# EAGLE design midimixer-channel (EAGLE 7.5.0)

## Sheet 1 of 2
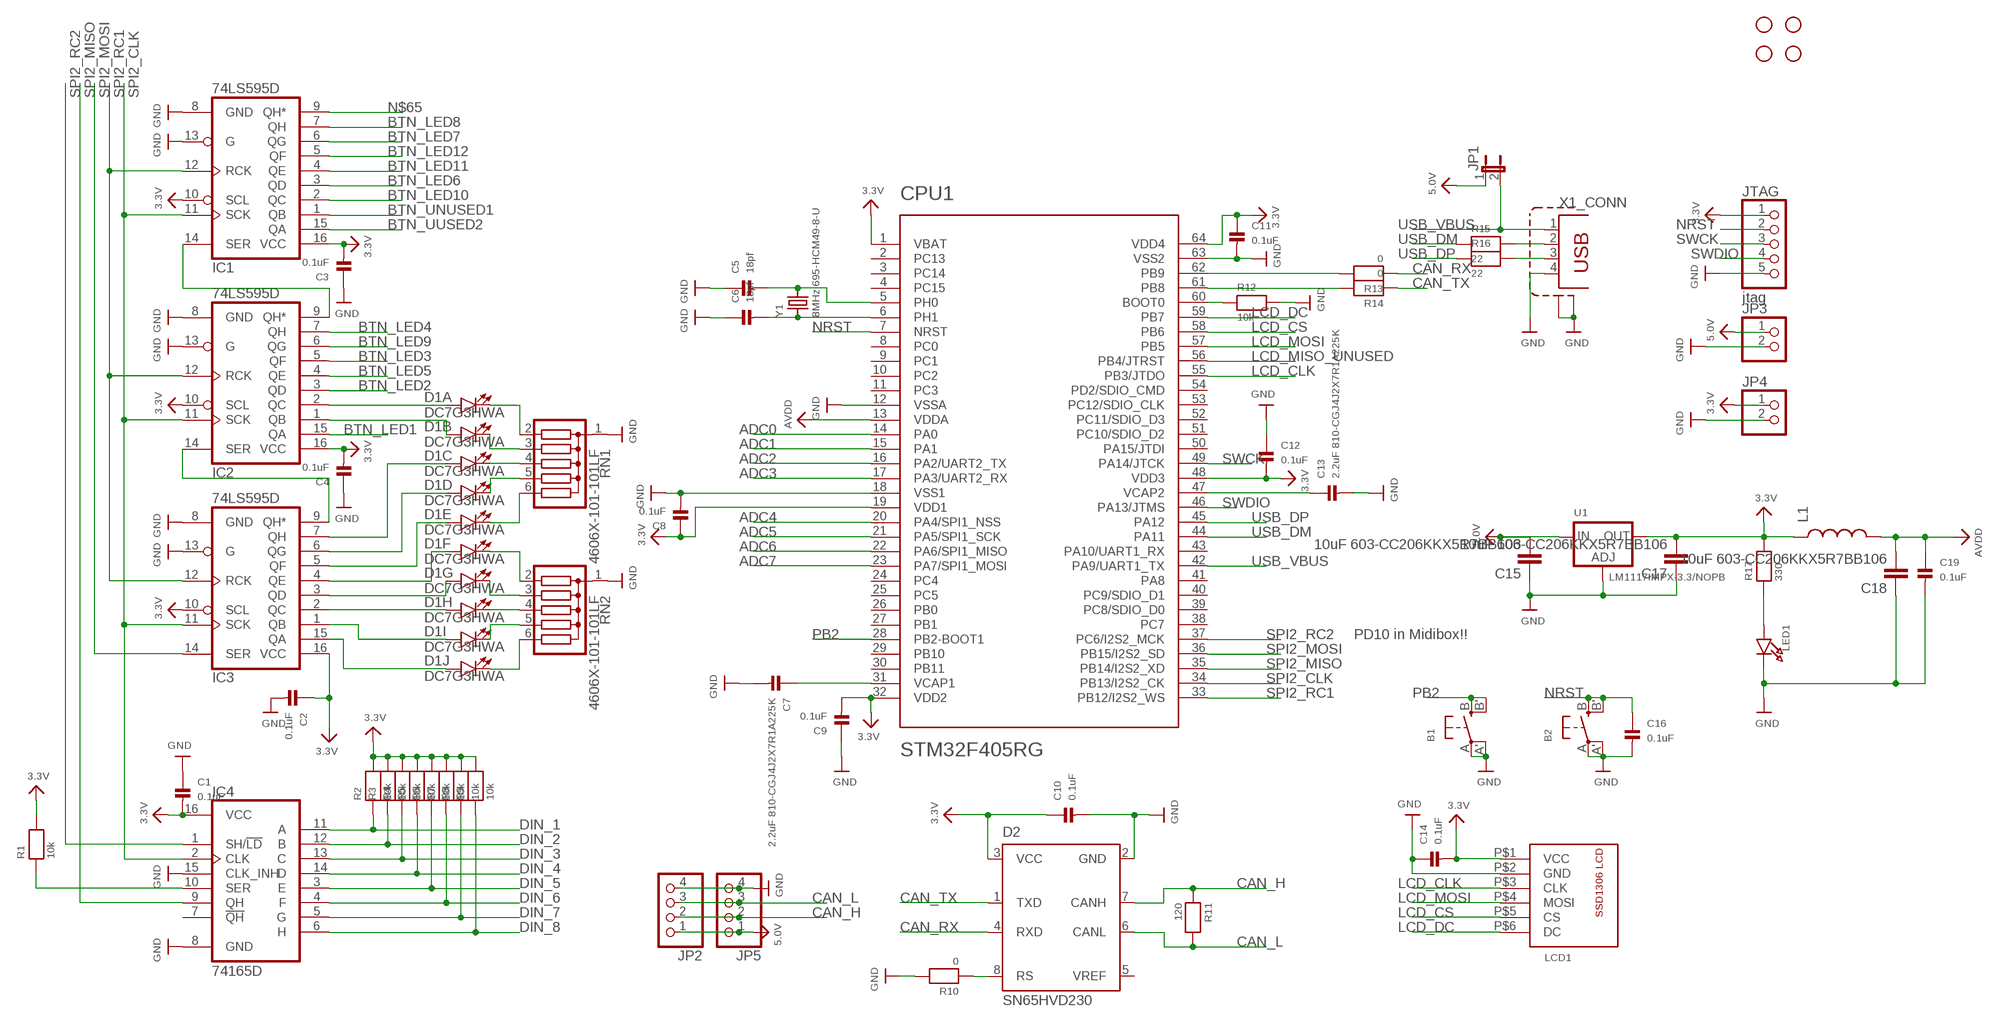
[diagram p0: schematic, sheet 1]

### Parts
B1  SWITCH_TACT_SMT  [EVQ-Q2]
B2  SWITCH_TACT_SMT  [EVQ-Q2]
C1  0.1uF  CAP_CERAMIC0603  [0603]
C2  0.1uF  CAP_CERAMIC0603  [0603]
C3  0.1uF  CAP_CERAMIC0603  [0603]
C4  0.1uF  CAP_CERAMIC0603  [0603]
C5  18pf  CAP_CERAMIC0603  [0603]
C6  18pf  CAP_CERAMIC0603  [0603]
C7  2.2uF 810-CGJ4J2X7R1A225K  CAP_CERAMIC0805  [0805]
C8  0.1uF  CAP_CERAMIC0603  [0603]
C9  0.1uF  CAP_CERAMIC0603  [0603]
C10  0.1uF  CAP_CERAMIC0603  [0603]
C11  0.1uF  CAP_CERAMIC0603  [0603]
C12  0.1uF  CAP_CERAMIC0603  [0603]
C13  2.2uF 810-CGJ4J2X7R1A225K  CAP_CERAMIC0805  [0805]
C14  0.1uF  CAP_CERAMIC0603  [0603]
C15  10uF 603-CC206KKX5R7BB106  CAP1206  [1206]
C16  0.1uF  CAP_CERAMIC0603  [0603]
C17  10uF 603-CC206KKX5R7BB106  CAP1206  [1206]
C18  10uF 603-CC206KKX5R7BB106  CAP1206  [1206]
C19  0.1uF  CAP_CERAMIC0603  [0603]
CPU1  STM32F405RG  [TQFP64]
D1  DC7G3HWA  LED_BARGRAPH_10  [LED_BARGAPH_10]
D2  SN65HVD230  [SO8]
H1  STAND-OFF  [STAND-OFF]
H2  STAND-OFF  [STAND-OFF]
H3  STAND-OFF  [STAND-OFF]
H4  STAND-OFF  [STAND-OFF]
IC1  74LS595D  [SO16]
IC2  74LS595D  [SO16]
IC3  74LS595D  [SO16]
IC4  74165D  [SO16]
JP1  JUMPER2  [JUMPER2]
JP2  HEADER-1X4ROUND  [1X04_ROUND]
JP3  HEADER-1X2ROUND  [1X02_ROUND]
JP4  HEADER-1X2ROUND  [1X02_ROUND]
JP5  HEADER-1X4ROUND  [1X04_ROUND]
JTAG  jtag  HEADER-1X576MIL  [1X05_ROUND_76]
L1  INDUCTOR0805  [0805]
LCD1  SSD1306-ALI  [SSD1306-ALI]
LED1  LED0603  [CHIPLED_0603]
R1  10k  RESISTOR_0603  [_0603]
R2  10k  RESISTOR_0603  [_0603]
R3  10k  RESISTOR_0603  [_0603]
R4  10k  RESISTOR_0603  [_0603]
R5  10k  RESISTOR_0603  [_0603]
R6  10k  RESISTOR_0603  [_0603]
R7  10k  RESISTOR_0603  [_0603]
R8  10k  RESISTOR_0603  [_0603]
R9  10k  RESISTOR_0603  [_0603]
R10  0  RESISTOR_0603  [_0603]
R11  120  RESISTOR_0603  [_0603]
R12  10k  RESISTOR_0603  [_0603]
R13  0  RESISTOR_0603  [_0603]
R14  0  RESISTOR_0603  [_0603]
R15  22  RESISTOR0603  [0603]
R16  22  RESISTOR0603  [0603]
R17  330  RESISTOR0603  [0603]
RN1  4606X-101-101LF  G05R  [SIL6]
RN2  4606X-101-101LF  G05R  [SIL6]
U1  LM1117IMPX-3.3/NOPB  LM1117SOT223-REFLOW  [SOT223-R]
X1  TE-292304-1  [TE-292304-1]
Y1  8MHz 695-HCM49-8-U  CRYSTALSMD  [HC49UP]

### Nets
3.3V: C1.2 C2.1 C3.2 C4.2 C8.1 C9.2 C10.1 C11.1 C12.2 C14.2 C17.2 CPU1.1(VBAT) CPU1.19(VDD1) CPU1.32(VDD2) CPU1.48(VDD3) CPU1.64(VDD4) D2.3(VCC) IC1.10(SCL) IC1.16(VCC) IC2.10(SCL) IC2.16(VCC) IC3.10(SCL) IC3.16(VCC) IC4.16(VCC) JP4.1 JTAG.1 L1.1 LCD1.P$1(VCC) R1.2 R2.2 R3.2 R4.2 R5.2 R6.2 R7.2 R8.2 R9.2 R17.2 U1.2(OUT) ; also sheet 2
5.0V: C15.2 JP1.1 JP2.1 JP3.1 JP5.1 U1.3(IN)
ADC0: CPU1.14(PA0) ; also sheet 2
ADC1: CPU1.15(PA1) ; also sheet 2
ADC2: CPU1.16(PA2/UART2_TX) ; also sheet 2
ADC3: CPU1.17(PA3/UART2_RX) ; also sheet 2
ADC4: CPU1.20(PA4/SPI1_NSS) ; also sheet 2
ADC5: CPU1.21(PA5/SPI1_SCK) ; also sheet 2
ADC6: CPU1.22(PA6/SPI1_MISO) ; also sheet 2
ADC7: CPU1.23(PA7/SPI1_MOSI) ; also sheet 2
AVDD: C18.2 C19.1 CPU1.13(VDDA) L1.2
BTN_LED1: IC2.15(QA) ; also sheet 2
BTN_LED2: IC2.3(QD) ; also sheet 2
BTN_LED3: IC2.5(QF) ; also sheet 2
BTN_LED4: IC2.7(QH) ; also sheet 2
BTN_LED5: IC2.4(QE) ; also sheet 2
BTN_LED6: IC1.3(QD) ; also sheet 2
BTN_LED7: IC1.6(QG) ; also sheet 2
BTN_LED8: IC1.7(QH) ; also sheet 2
BTN_LED9: IC2.6(QG) ; also sheet 2
BTN_LED10: IC1.2(QC) ; also sheet 2
BTN_LED11: IC1.4(QE) ; also sheet 2
BTN_LED12: IC1.5(QF) ; also sheet 2
BTN_UNUSED1: IC1.1(QB)
BTN_UUSED2: IC1.15(QA)
CAN_H: D2.7(CANH) JP2.2 JP5.2 R11.1
CAN_L: D2.6(CANL) JP2.3 JP5.3 R11.2
CAN_RX: D2.4(RXD) R13.1
CAN_TX: D2.1(TXD) R14.1
DIN_1: IC4.11(A) R2.1 ; also sheet 2
DIN_2: IC4.12(B) R3.1 ; also sheet 2
DIN_3: IC4.13(C) R4.1 ; also sheet 2
DIN_4: IC4.14(D) R5.1
DIN_5: IC4.3(E) R6.1 ; also sheet 2
DIN_6: IC4.4(F) R7.1 ; also sheet 2
DIN_7: IC4.5(G) R8.1 ; also sheet 2
DIN_8: IC4.6(H) R9.1
GND: B1.A'(P1) B1.A(P) B2.A'(P1) B2.A(P) C1.1 C2.2 C3.1 C4.1 C5.1 C6.1 C7.2 C8.2 C9.1 C10.2 C11.2 C12.1 C13.2 C14.1 C15.1 C16.2 C17.1 C18.1 C19.2 CPU1.12(VSSA) CPU1.18(VSS1) CPU1.63(VSS2) D2.2(GND) IC1.8(GND) IC1.13(G) IC2.8(GND) IC2.13(G) IC3.8(GND) IC3.13(G) IC4.8(GND) IC4.15(CLK_INH) JP2.4 JP3.2 JP4.2 JP5.4 JTAG.5 LCD1.P$2(GND) LED1.C R10.2 R12.2 RN1.1 RN2.1 U1.1(ADJ) X1.4 X1.P$1(SHIELD:S1) X1.P$2(SHIELD:S2) ; also sheet 2
LCD_CLK: CPU1.55(PB3/JTDO) LCD1.P$3(CLK)
LCD_CS: CPU1.58(PB6) LCD1.P$5(CS)
LCD_DC: CPU1.59(PB7) LCD1.P$6(DC)
LCD_MISO_UNUSED: CPU1.56(PB4/JTRST)
LCD_MOSI: CPU1.57(PB5) LCD1.P$4(MOSI)
N$1: C6.2 CPU1.6(PH1) Y1.1
N$2: C5.2 CPU1.5(PH0) Y1.2
N$3: C13.1 CPU1.47(VCAP2)
N$4: C7.1 CPU1.31(VCAP1)
N$5: LED1.A R17.1
N$6: CPU1.60(BOOT0) R12.1
N$7: R15.2 X1.2
N$8: R16.2 X1.3
N$11: D1.2(B:A) IC2.1(QB)
N$12: IC1.14(SER) IC2.9(QH*)
N$13: CPU1.62(PB9) R13.2
N$14: D1.20(A:C) RN1.2
N$15: D1.19(B:C) RN1.3
N$16: D1.18(C:C) RN1.4
N$17: D1.17(D:C) RN1.5
N$18: D1.16(E:C) RN1.6
N$19: D1.15(F:C) RN2.2
N$20: D1.14(G:C) RN2.3
N$21: D1.13(H:C) RN2.4
N$22: D1.12(I:C) RN2.5
N$23: D1.11(J:C) RN2.6
N$27: CPU1.61(PB8) R14.2
N$28: IC4.10(SER) R1.1
N$31: D1.1(A:A) IC2.2(QC)
N$49: D1.10(J:A) IC3.15(QA)
N$50: D1.9(I:A) IC3.1(QB)
N$51: D1.8(H:A) IC3.2(QC)
N$52: D1.7(G:A) IC3.3(QD)
N$53: D1.6(F:A) IC3.4(QE)
N$54: D1.5(E:A) IC3.5(QF)
N$55: D1.4(D:A) IC3.6(QG)
N$56: D1.3(C:A) IC3.7(QH)
N$57: IC2.14(SER) IC3.9(QH*)
N$65: IC1.9(QH*)
N$73: D2.8(RS) R10.1
NRST: B2.B'(S1) B2.B(S) C16.1 CPU1.7(NRST) JTAG.2
PB2: B1.B'(S1) B1.B(S) CPU1.28(PB2-BOOT1)
SPI2_CLK: CPU1.34(PB13/I2S2_CK) IC1.11(SCK) IC2.11(SCK) IC3.11(SCK) IC4.2(CLK)
SPI2_MISO: CPU1.35(PB14/I2S2_XD) IC4.9(QH)
SPI2_MOSI: CPU1.36(PB15/I2S2_SD) IC3.14(SER)
SPI2_RC1: CPU1.33(PB12/I2S2_WS) IC1.12(RCK) IC2.12(RCK) IC3.12(RCK)
SPI2_RC2: CPU1.37(PC6/I2S2_MCK) IC4.1(SH/!LD)
SWCK: CPU1.49(PA14/JTCK) JTAG.3
SWDIO: CPU1.46(PA13/JTMS) JTAG.4
USB_DM: CPU1.44(PA11) R15.1
USB_DP: CPU1.45(PA12) R16.1
USB_VBUS: CPU1.42(PA9/UART1_TX) JP1.2 X1.1
Unconnected: CPU1.2(PC13) CPU1.3(PC14) CPU1.4(PC15) CPU1.8(PC0) CPU1.9(PC1) CPU1.10(PC2) CPU1.11(PC3) CPU1.24(PC4) CPU1.25(PC5) CPU1.26(PB0) CPU1.27(PB1) CPU1.29(PB10) CPU1.30(PB11) CPU1.38(PC7) CPU1.39(PC8/SDIO_D0) CPU1.40(PC9/SDIO_D1) CPU1.41(PA8) CPU1.43(PA10/UART1_RX) CPU1.50(PA15/JTDI) CPU1.51(PC10/SDIO_D2) CPU1.52(PC11/SDIO_D3) CPU1.53(PC12/SDIO_CLK) CPU1.54(PD2/SDIO_CMD) D2.5(VREF) IC4.7(!QH)

### Notes on the sheet
- PD10 in Midibox!!

## Sheet 2 of 2
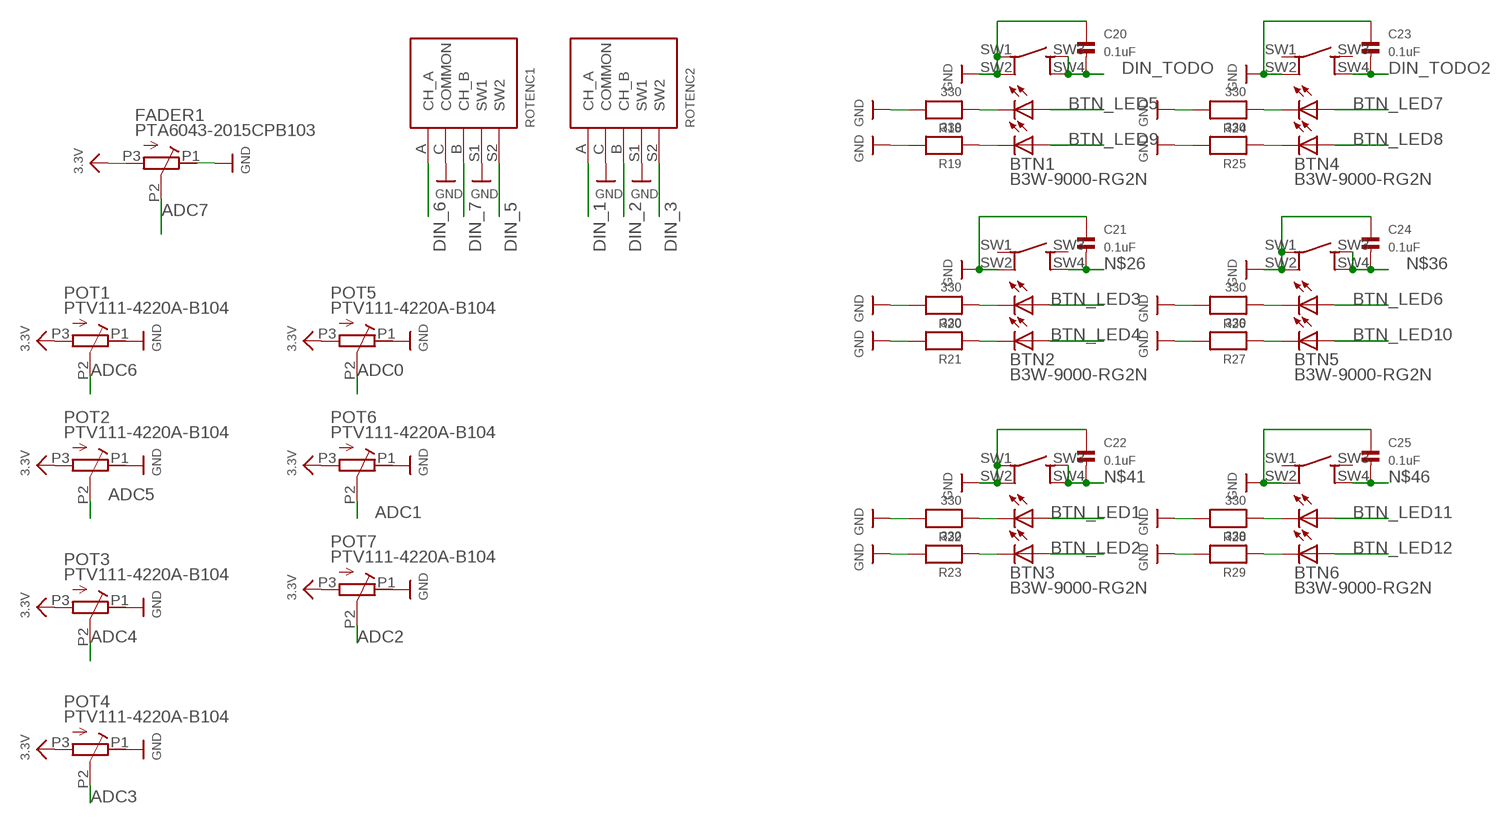
[diagram p1: schematic, sheet 2]

### Parts
BTN1  B3W-9000-RG2N  [B3W-9000-X2X]
BTN2  B3W-9000-RG2N  [B3W-9000-X2X]
BTN3  B3W-9000-RG2N  [B3W-9000-X2X]
BTN4  B3W-9000-RG2N  [B3W-9000-X2X]
BTN5  B3W-9000-RG2N  [B3W-9000-X2X]
BTN6  B3W-9000-RG2N  [B3W-9000-X2X]
C20  0.1uF  CAP_CERAMIC0603  [0603]
C21  0.1uF  CAP_CERAMIC0603  [0603]
C22  0.1uF  CAP_CERAMIC0603  [0603]
C23  0.1uF  CAP_CERAMIC0603  [0603]
C24  0.1uF  CAP_CERAMIC0603  [0603]
C25  0.1uF  CAP_CERAMIC0603  [0603]
FADER1  PTA6043-2015CPB103  [PTA6043-2015CPB103]
POT1  PTV111-4220A-B104  [PTV111-4]
POT2  PTV111-4220A-B104  [PTV111-4]
POT3  PTV111-4220A-B104  [PTV111-4]
POT4  PTV111-4220A-B104  [PTV111-4]
POT5  PTV111-4220A-B104  [PTV111-4]
POT6  PTV111-4220A-B104  [PTV111-4]
POT7  PTV111-4220A-B104  [PTV111-4]
R18  330  RESISTOR0603  [0603]
R19  330  RESISTOR0603  [0603]
R20  330  RESISTOR0603  [0603]
R21  330  RESISTOR0603  [0603]
R22  330  RESISTOR0603  [0603]
R23  330  RESISTOR0603  [0603]
R24  330  RESISTOR0603  [0603]
R25  330  RESISTOR0603  [0603]
R26  330  RESISTOR0603  [0603]
R27  330  RESISTOR0603  [0603]
R28  330  RESISTOR0603  [0603]
R29  330  RESISTOR0603  [0603]
ROTENC1  PEC11-4215K-S0024  [PEC111-4XXXK-SXXXX]
ROTENC2  PEC11-4215K-S0024  [PEC111-4XXXK-SXXXX]

### Nets
3.3V: FADER1.P3(E) POT1.P3(E) POT2.P3(E) POT3.P3(E) POT4.P3(E) POT5.P3(E) POT6.P3(E) POT7.P3(E) ; also sheet 1
ADC0: POT5.P2(S) ; also sheet 1
ADC1: POT6.P2(S) ; also sheet 1
ADC2: POT7.P2(S) ; also sheet 1
ADC3: POT4.P2(S) ; also sheet 1
ADC4: POT3.P2(S) ; also sheet 1
ADC5: POT2.P2(S) ; also sheet 1
ADC6: POT1.P2(S) ; also sheet 1
ADC7: FADER1.P2(S) ; also sheet 1
BTN_LED1: BTN3.LED1+ ; also sheet 1
BTN_LED2: BTN3.LED2+ ; also sheet 1
BTN_LED3: BTN2.LED1+ ; also sheet 1
BTN_LED4: BTN2.LED2+ ; also sheet 1
BTN_LED5: BTN1.LED1+ ; also sheet 1
BTN_LED6: BTN5.LED1+ ; also sheet 1
BTN_LED7: BTN4.LED1+ ; also sheet 1
BTN_LED8: BTN4.LED2+ ; also sheet 1
BTN_LED9: BTN1.LED2+ ; also sheet 1
BTN_LED10: BTN5.LED2+ ; also sheet 1
BTN_LED11: BTN6.LED1+ ; also sheet 1
BTN_LED12: BTN6.LED2+ ; also sheet 1
DIN_1: ROTENC2.A(CH_A) ; also sheet 1
DIN_2: ROTENC2.B(CH_B) ; also sheet 1
DIN_3: ROTENC2.S2(SW2) ; also sheet 1
DIN_5: ROTENC1.S2(SW2) ; also sheet 1
DIN_6: ROTENC1.A(CH_A) ; also sheet 1
DIN_7: ROTENC1.B(CH_B) ; also sheet 1
DIN_TODO: BTN1.SW3(SW2_A) BTN1.SW4(SW2_B) C20.2
DIN_TODO2: BTN4.SW4(SW2_B) C23.2
GND: BTN1.SW1(SW1_A) BTN1.SW2(SW1_B) BTN2.SW2(SW1_B) BTN3.SW1(SW1_A) BTN3.SW2(SW1_B) BTN4.SW2(SW1_B) BTN5.SW1(SW1_A) BTN5.SW2(SW1_B) BTN6.SW2(SW1_B) C20.1 C21.1 C22.1 C23.1 C24.1 C25.1 FADER1.P1(A) POT1.P1(A) POT2.P1(A) POT3.P1(A) POT4.P1(A) POT5.P1(A) POT6.P1(A) POT7.P1(A) R18.2 R19.2 R20.2 R21.2 R22.2 R23.2 R24.2 R25.2 R26.2 R27.2 R28.2 R29.2 ROTENC1.C(COMMON) ROTENC1.S1(SW1) ROTENC2.C(COMMON) ROTENC2.S1(SW1) ; also sheet 1
N$9: BTN1.LED1- R18.1
N$10: BTN1.LED2- R19.1
N$24: BTN2.LED1- R20.1
N$25: BTN2.LED2- R21.1
N$26: BTN2.SW4(SW2_B) C21.2
N$29: BTN4.LED1- R24.1
N$30: BTN4.LED2- R25.1
N$34: BTN5.LED1- R26.1
N$35: BTN5.LED2- R27.1
N$36: BTN5.SW3(SW2_A) BTN5.SW4(SW2_B) C24.2
N$39: BTN3.LED1- R22.1
N$40: BTN3.LED2- R23.1
N$41: BTN3.SW3(SW2_A) BTN3.SW4(SW2_B) C22.2
N$44: BTN6.LED1- R28.1
N$45: BTN6.LED2- R29.1
N$46: BTN6.SW4(SW2_B) C25.2
Unconnected: BTN2.SW1(SW1_A) BTN2.SW3(SW2_A) BTN4.SW1(SW1_A) BTN4.SW3(SW2_A) BTN6.SW1(SW1_A) BTN6.SW3(SW2_A)

## Library data of the parts
B1 B2 = microbuilder:SWITCH_TACT_SMT: SMT Tact Switches 6x6mm - Digikey: P12940SCT-ND KMR2 (4.6x2.8mm) - Digikey: 401-1426-1-ND EVQ-PQHB55 - Light Touch, 160GF (4.5x4.5mm) - Digikey: P8090SCT-ND
BTN1-BTN6 = keves:B3W-9000-RG2N
C1-C14 C16 C19-C25 = microbuilder:CAP_CERAMIC: Ceramic Capacitors 0402 - 0402 Surface Mount Capacitors 16pF 50V 5% [Digikey: 445-4899-2-ND] 18pF 50V 5% [Digikey: 490-1281-2-ND] 22pF 50V 5% [Digikey: 490-1283-2-ND] 68pF 50V 5% [Digikey: 490-1289-2-ND] 0.1uF 10V 10% [Digikey: 490-1318-2-ND] 1.0uF 6.3V 10% [Digikey: 490-1320-2-ND] 0603 - 0603 Surface Mount Capacitors 16 pF 50V 5% [Digikey: 445-5051-2-ND] 22 pF 50V [Digikey: PCC220ACVTR-ND] 33 pF 50V 5% [Digikey: 490-1415-1-ND] 56pF 50V 5% [Digikey: 490-1421-1-ND] 220pF 50V 5% [Digikey: 445-1285-1-ND] 680 pF 50V 2200 pF 50V 5% C0G [Digikey: 445-1297-1-ND] 5600 pF 100V 5% X7R [Digikey: 478-3711-1-ND] 0.1 µF 25V 10% [Digikey: PCC2277TR-ND] 0.22 µF 16V 10% X7R [Digikey: 445-1318-1-ND] 1.0 µF 25V 10% [Digikey: 445-5146-2-ND] 0603 - RF Specific 3pF 250V +/-0.1pF RF [Digikey: 712-1347-1-ND] 18 pF 250V 5% [Digikey: 478-3505-1-ND or 712-1322-1-ND] 56 pF 250V 5% C0G RF [Digikey: 490-4867-1-ND] 68 pF 250V RF [Digikey: 490-4868-1-ND] 0805 - 0805 Surface Mount Capacitors 220 pF 250V 2% RF Ceramic Capacitor [Digikey: 712-1398-1-ND] 1000 pF 50V 2% NP0 Ceramic Capacitor [Digikey: 478-3760-1-ND] 0.1 µF 25V 10% Ceramic Capacitor [Digikey: PCC1828TR-ND] 1.0 µF 16V 10% Ceramic Capacitor[Digikey: 490-1691-2-ND] 10.0 µF 10V 10% Ceramic Capacitor[Digikey: 709-1228-1-ND] 10.0 uF 16V 10% Ceramic Capacitor [Digikey: 478-5165-2-ND] 47 uF 6.3V 20% Ceramic Capacitor [Digikey: 587-1779-1-ND or 399-5506-1-ND] 1206 - 1206 Surface Mount Capacitors 47uF 10V 20% Ceramic Capacitor [Digikey: 490-5528-1-ND or 399-5508-1-ND or 445-6010-1-ND] 100uF 6.3V -20%, +80% Y5V Ceramic Capacitor (Digikey: 490-4512-1-ND, Mouser: 81-GRM31CF50J107ZE1L)
C15 C17 C18 = SparkFun-Passives:CAP: Capacitor Standard 0603 ceramic capacitor, and 0.1" leaded capacitor.
CPU1 = SparkFun-DigitalIC:STM32F405RG: ARM DSP Chip used on the WAV Trigger board.
D1 = SparkFun-LED:LED_BARGRAPH_10: 10-Segment LED Bar Graph SFE part numbers: COM-09935 (red, Vf = 2.1V, Ifmax = 20mA) COM-09936 (yellow, Vf = 2.1V, Ifmax = 20mA) COM-09937 (blue, Vf = 3.4V, Ifmax = 20mA) COM-09938 (green, Vf = 3.4V, Ifmax = 20mA)
D2 = omc:SN65HVD230: SN65HVD230 - 3.3V CAN Transceiver - 3.3V operation - ISO 11898 compliant - up to 1Mbps - up to 120 nodes - listen only mode - slope control
FADER1 = keves:PTA6043-2015CPB103
H1-H4 = SparkFun-Electromechanical:STAND-OFF: #4 Stand Off This is the mechanical footprint for a #4 phillips button head screw. Use the keepout ring to avoid running the screw head into surrounding components. SKU : PRT-00447
IC1-IC3 = SparkFun-DigitalIC:74*595: 8-bit SHIFT REGISTER, output latch; PROD_ID: IC-07875
IC4 = SparkFun-DigitalIC:74*165
JP1 = microbuilder:JUMPER2: JUMPER - 2 Pins
JP2 JP5 = microbuilder:HEADER-1X4: PIN HEADER
JP3 JP4 = microbuilder:HEADER-1X2: PIN HEADER
JTAG = microbuilder:HEADER-1X5: PIN HEADER
L1 = SparkFun-Passives:INDUCTOR: Inductors Basic Inductor/Choke - 0603 and 1206. Footprints are not proven and vary greatly between part numbers. INDUCTOR POWER 3.3UH 4.0A SMD 0.197" L x 0.197" W x 0.177" H (5.00mm x 5.00mm x 4.50mm)
LCD1 = keves:SSD1306-ALI
LED1 = microbuilder:LED: LED 0603 - 0603 Surface Mount Package 2mA: Green LED - Low Power (3.9mcd, 2ma, 1.7Vf) - Digikey: 475-2709-2-ND Orange LED - Low Power (9.8mcd, 2ma, 1.8Vf) - Digikey: 475-1194-2-ND Red LED - Low Power (5mcd, 2ma, 1.8Vf) - Digikey: 475-1195-2-ND Yellow LED - Low Power (7mcd, 2ma, 1.8Vf) - Digikey: 475-1196-2-ND 5mA: Blue LED - Low Power (17mcd, 5ma, 2.9Vf) - Digikey: LNJ937W8CRACT-ND 0805 - 0805 Surface Mount Package 2mA: Red LED (8.8mcd, 2mA, 1.8Vf, Clear) - Low Power [Digikey: 475-2510-1-ND] Green LED (5mcd, 2mA, 1.8Vf, Clear) - Low Power [Digikey: 475-2730-1-ND] Yellow LED (11.3mcd, 2mA, 1.8Vf, Clear) - Low Power [Digikey: 475-2555-1-ND] 20mA: Red LED (104mcd, 20mA, Diffused) - LS R976 [Digikey: 475-1278-6-ND] Red LED (12mcd, 20mA, 2.0Vf, Clear) - APT2012EC [Digikey: 754-1128-1-ND] Green LED (15mcd, 20mA, 2.2Vf, Clear) - APT2012GC [Digikey: 754-1131-1-ND] Orange LED (160mcd, 20mA, 2.1Vf, Clear) - APT2012SECK [Digikey: 754-1130-1-ND] 1206 - 1206 Surface Mount Package Green LED (26mcd, 20mA, Diffused) - LG N971 [Digikey: 475-1407-6-ND] Red LED (15mcd, 20mA, Diffused) - LH N974 [Digikey: 475-1416-6-ND]
POT1-POT7 = keves:PTV111-4220A-B104: ROT POT PTV111-4220A-B104 http://www.bourns.com/data/global/pdfs/PTVPTT.pdf
R1-R29 = microbuilder:RESISTOR: Resistors 0402 - 0402 Surface Mount Package 22 Ohm 1% 1/16W [Digikey: 311-22.0LRTR-ND] 33 Ohm 5% 1/16W 1.0K 5% 1/16W 1.5K 5% 1/16W 2.0K 1% 1/16W 10.0K 1% 1/16W [Digikey: 311-10.0KLRTR-ND] 10.0K 5% 1/16W [Digikey: RMCF0402JT10K0TR-ND] 12.1K 1% 1/16W [Digikey: 311-22.0LRTR-ND] 100.0K 5% 1/16W 0603 - 0603 Surface Mount Package 0 Ohm 1/10 Watt 1% Resistor 15 Ohm 1/10 Watt 1% Resistor 33 Ohm 1/10 Watt 1% Resistor 49.9 Ohm 1/10 Watt 1% Resistor 100 Ohm 1/10 Watt 1% Resistor 150 Ohm 1/10 Watt 1% Resistor 240 Ohm 1/10 Watt 1% Resistor 390 Ohm 1/10 Watt 1% Resistor 560 Ohm 1/10 Watt 1% Resistor 680 Ohm 1/10 Watt 1% Resistor 750 Ohm 1/10 Watt 1% Resistor 1.0K Ohm 1/10 Watt 1% Resistor 1.5K Ohm 1/10 Watt 1% Resistor 2.0K Ohm 1/10 Watt 1% Resistor 2.2K Ohm 1/10 Watt 1% Resistor 3.3K Ohm 1/10 Watt 1% Resistor 4.7K Ohm 1/10 Watt 1% Resistor 10.0K Ohm 1/10 Watt 1% Resistor 12.0K Ohm 1/10 Watt 1% Resistor 12.1K Ohm 1/10 Watt 1% Resistor 20.0K Ohm 1/10 Watt 1% Resistor 33.0K Ohm 1/10 Watt 1% Resistor 100.0K Ohm 1/10 Watt 1% Resistor 0805 - 0805 Surface Mount Package 0 Ohm 1/8 Watt 1% Resistor 33 Ohm 1/8 Watt 1% Resistor 100 Ohm 1/8 Watt 1% Resistor 150 Ohm 1/8 Watt 1% Resistor 200 Ohm 1/8 Watt 1% Resistor 240 Ohm 1/8 Watt 1% Resistor 330 Ohm 1/8 Watt 1% Resistor 390 Ohm 1/8 Watt 1% Resistor 470 Ohm 1/8 Watt 1% Resistor 1.0K Ohm 1/8 Watt 1% Resistor 1.5K Ohm 1/8 Watt 1% Resistor 2.0K Ohm 1/8 Watt 1% Resistor 4.7K Ohm 1/8 Watt 1% Resistor 5.1K Ohm 1/8 Watt 1% Resistor 5.6K Ohm 1/8 Watt 1% Resistor 10.0K Ohm 1/8 Watt 1% Resistor 22.0K Ohm 1/8 Watt 1% Resistor 33.0K Ohm 1/8 Watt 1% Resistor 100K Ohm 1/8 Watt 1% Resistor 1206 - 1206 Surface Mount Package 2012 - 2010 Surface Mount Package 0.11 Ohm 1/2 Watt 1% Resistor - Digikey: RHM.11UCT-ND
RN1 RN2 = resistor-sil:G05R: SIL RESISTOR; OC_FARNELL: unknown; OC_NEWARK: unknown
ROTENC1 ROTENC2 = keves:PEC11-4215K-S0024
U1 = microbuilder:LM1117: LM1117 Voltage Regulator LM1117 Adjustable Voltage regulator [Digikey: LM1117IMP-ADJDKR-ND] LM1117 3.3V Voltage regulator [AP1117E33GDIDKR-ND] LM1117 5.0V Voltage regulator [AP1117E50GDIDKR-ND] SOT223-REFLOW - SOT223 package for solder paste/reflow ovens SOT223-WAVE - SOT223 package for hand-soldering (larger pads) Note: For the fixed-voltage regulators, simply set the ADJ pin to GND.
X1 = keves:TE-292304-1: USB A Female connector
Y1 = microbuilder:CRYSTAL: Crystals HC49UP - Surface Mount Crystal 4.0MHz 18pF +/-30ppm Surface Mount Crystal [Digikey: 535-9857-1-ND] 12.0 MHz Surface Mount Crystal [Digikey: 535-9869-6-ND] 25.0 MHz Surface Mount Crystal [Digikey: 535-9078-1-ND] 2.5 x 2.0mm - MEMs SMT Crystal 16.0 MHz 10pF 20ppm 2.5 x 2.0mm Crystal [Digikey -40-85°C: 535-10923-1-ND] 3.2 x 2.5mm - MEMs SMT Crystal 12.0 MHz 8pF 15ppm 3.2 x 2.5mm Crystal [Digikey: -10-70°C: 644-1047-1-ND -40-125°C: 644-1128-1-ND] 16.0 MHz 8pF 15ppm 3.2 x 2.5mm Crystal [Digikey: -10-70°C: 644-1049-1-ND -40-125°C: 644-1129-2-ND] 16.0 MHz 10pF 10ppm 3.2 x 2.5mm Crystal [Digikey: 644-1100-1-ND] 27.12 MHz 18pF 30ppm 3.2 x 2.5mm Crystal [Digikey: 887-1424-1-ND] 27.12MHz 10pF 10ppm 3.2 x 2.5mm Crystal [Digikey: 887-1329-1-ND] 4.9 x 1.8mm - MEMs SMT Crystal 32.768 KHz 12.5pF 20ppm 4.9 x 1.8mm Crystal [Digikey: SE2415CT-ND] 8.0 x 3.8mm - Surface Mount Crystal 32.768kHz 12.5pF 20ppm -40°C-85°C [Digikey: 535-9166-2-ND] Cylinder 32.768KHz Cylinder Crystal (2x6mm body) [Ex. Digikey: 300-8341-2-ND]

## Board
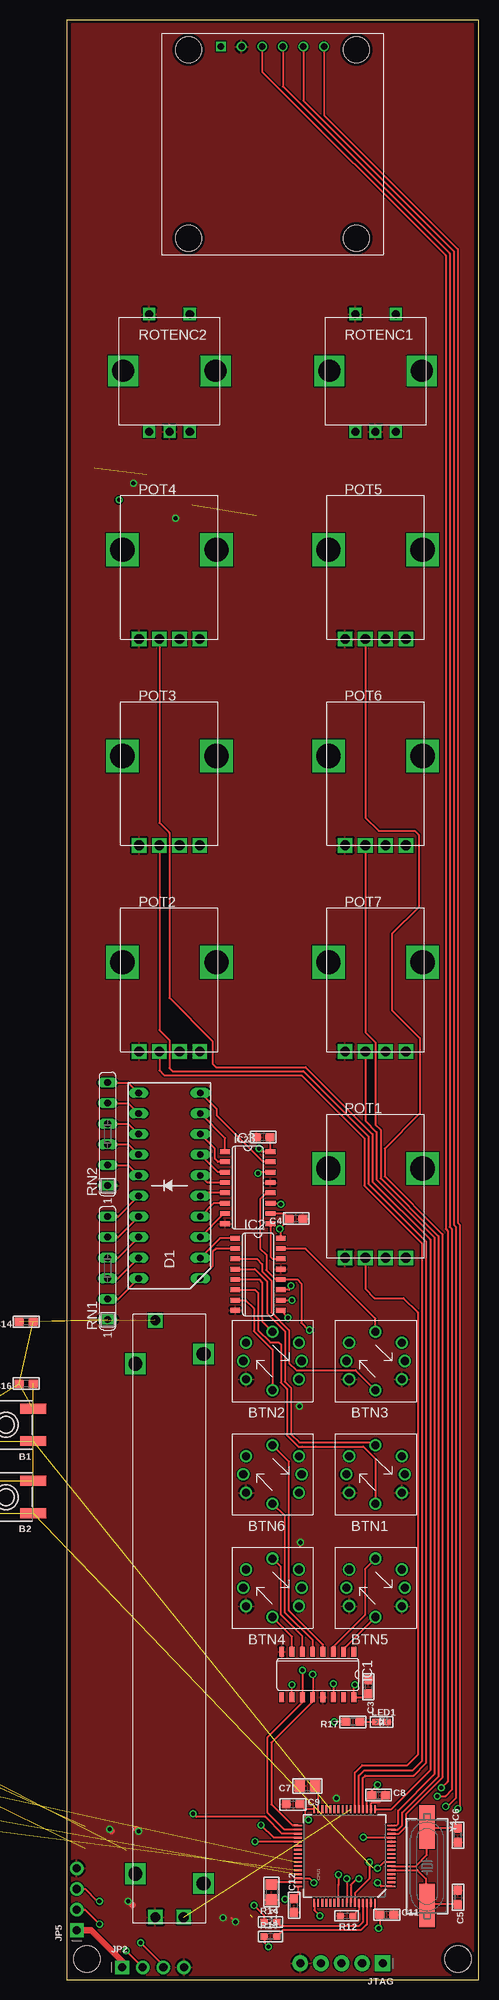
[diagram p2: board, top side]
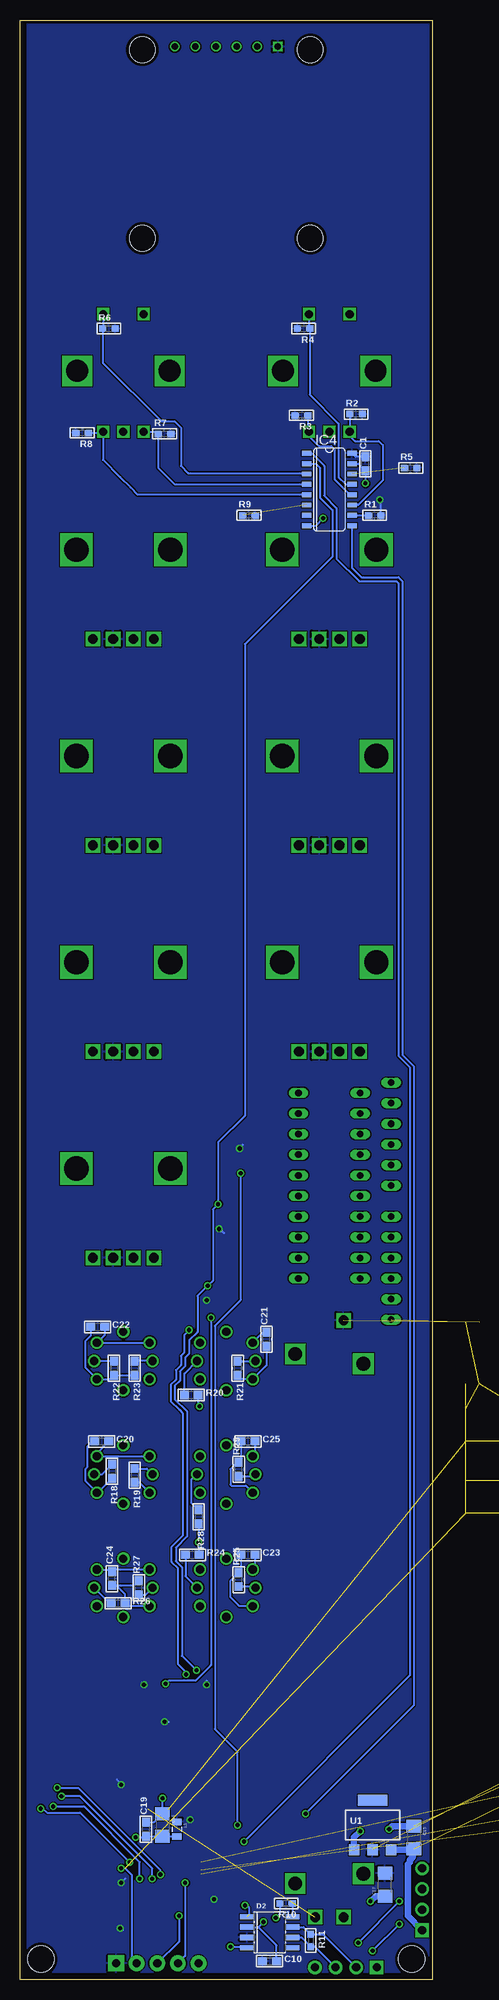
[diagram p3: board, bottom side, seen from below]

Size 50.8 x 241.3 mm. Coordinates in mm from the lower left corner, seen from the top.
Outline: 0,0 50.8,0 50.8,241.3 0,241.3 0,0
Copper layers (1*16): Top 0.0356mm / dielectric 1.5011mm / Bottom 0.0356mm
Design rules "LaenPCBOrder *": minimum track width 6mil, minimum drill 13mil, track to track 6mil, track to pad 6mil, pad to pad 6mil, via to via 6mil, smd to smd 6mil, copper to edge 15mil, drill to drill 6mil, minimum pad ring 7mil, minimum via ring 7mil, stop-mask expansion 3mil, vias tented up to drill 0mil, thermal gap 10mil

### Footprints (pad centres in the part's own frame; a part is rotated, then mirrored left to right if it is on the bottom)
EVQ-Q2 = smd 3.2 x 1.2: A -3.4,-2; A' 3.4,-2; B -3.4,2; B' 3.4,2
B3W-9000-X2X = drill 1: LED1+ 0,3.6; LED1- 3.6,0; LED2+ 0,-3.6; LED2- -3.6,0; SW1 3.25,-2.25; SW2 -3.25,-2.25; SW3 3.25,2.25; SW4 -3.25,2.25
0603 = smd 1.1 x 1: 1 -0.85,0; 2 0.85,0
0805 = smd 1.3 x 1.5: 1 -0.95,0; 2 0.95,0
1206 = smd 1.6 x 1.8: 1 -1.4,0; 2 1.4,0
TQFP64 = smd 0.22 x 1: 1 -3.75,-5.75; 2 -3.25,-5.75; 3 -2.75,-5.75; 4 -2.25,-5.75; 5 -1.75,-5.75; 6 -1.25,-5.75; 7 -0.75,-5.75; 8 -0.25,-5.75; 9 0.25,-5.75; 10 0.75,-5.75; 11 1.25,-5.75; 12 1.75,-5.75; 13 2.25,-5.75; 14 2.75,-5.75; 15 3.25,-5.75; 16 3.75,-5.75; 33 3.75,5.75; 34 3.25,5.75; 35 2.75,5.75; 36 2.25,5.75; 37 1.75,5.75; 38 1.25,5.75; 39 0.75,5.75; 40 0.25,5.75; 41 -0.25,5.75; 42 -0.75,5.75; 43 -1.25,5.75; 44 -1.75,5.75; 45 -2.25,5.75; 46 -2.75,5.75; 47 -3.25,5.75; 48 -3.75,5.75 | smd 1 x 0.22: 17 5.75,-3.75; 18 5.75,-3.25; 19 5.75,-2.75; 20 5.75,-2.25; 21 5.75,-1.75; 22 5.75,-1.25; 23 5.75,-0.75; 24 5.75,-0.25; 25 5.75,0.25; 26 5.75,0.75; 27 5.75,1.25; 28 5.75,1.75; 29 5.75,2.25; 30 5.75,2.75; 31 5.75,3.25; 32 5.75,3.75; 49 -5.75,3.75; 50 -5.75,3.25; 51 -5.75,2.75; 52 -5.75,2.25; 53 -5.75,1.75; 54 -5.75,1.25; 55 -5.75,0.75; 56 -5.75,0.25; 57 -5.75,-0.25; 58 -5.75,-0.75; 59 -5.75,-1.25; 60 -5.75,-1.75; 61 -5.75,-2.25; 62 -5.75,-2.75; 63 -5.75,-3.25; 64 -5.75,-3.75
LED_BARGAPH_10 = drill 0.813 long: 1 -11.43,-3.81; 2 -8.89,-3.81; 3 -6.35,-3.81; 4 -3.81,-3.81; 5 -1.27,-3.81; 6 1.27,-3.81; 7 3.81,-3.81; 8 6.35,-3.81; 9 8.89,-3.81; 10 11.43,-3.81; 11 11.43,3.81; 12 8.89,3.81; 13 6.35,3.81; 14 3.81,3.81; 15 1.27,3.81; 16 -1.27,3.81; 17 -3.81,3.81; 18 -6.35,3.81; 19 -8.89,3.81; 20 -11.43,3.81
SO8 = smd 0.65 x 1.75: 1 -1.905,-2.8; 2 -0.635,-2.8; 3 0.635,-2.8; 4 1.905,-2.8; 5 1.905,2.8; 6 0.635,2.8; 7 -0.635,2.8; 8 -1.905,2.8
PTA6043-2015CPB103 = drill 1.2 square: P1 -36.75,1.75; P2 -36.75,-1.75; P3 36.75,1.75 | drill 1.7 square: P$1 -31.4,4.2; P$2 31.4,4.2; P$3 -32.6,-4.2; P$4 32.6,-4.2
STAND-OFF = hole 3.302: 0,0
SO16 = smd 0.6 x 1.2: 1 -4.445,-2.8; 2 -3.175,-2.8; 3 -1.905,-2.8; 4 -0.635,-2.8; 5 0.635,-2.8; 6 1.905,-2.8; 7 3.175,-2.8; 8 4.445,-2.8; 9 4.445,2.8; 10 3.175,2.8; 11 1.905,2.8; 12 0.635,2.8; 13 -0.635,2.8; 14 -1.905,2.8; 15 -3.175,2.8; 16 -4.445,2.8
JUMPER2 = drill 1 pad 1.93 octagon: 1 2.54,0; 2 0,0
1X04_ROUND = drill 1 pad 1.676 square: 1 -3.81,0 | drill 1 pad 1.676: 2 -1.27,0; 3 1.27,0; 4 3.81,0
1X02_ROUND = drill 1 pad 1.676 square: 1 -1.27,0 | drill 1 pad 1.676: 2 1.27,0
1X05_ROUND_76 = drill 1 pad 1.93 square: 1 -5.08,0 | drill 1 pad 1.93: 2 -2.54,0; 3 0,0; 4 2.54,0; 5 5.08,0
0805' = smd 0.8 x 1.2: 1 -0.9,0; 2 0.9,0
SSD1306-ALI = drill 0.8 square: P$1 -6.35,12 | drill 0.8: P$2 -3.81,12; P$3 -1.27,12; P$4 1.27,12; P$5 3.81,12; P$6 6.35,12 | hole 3.2: -10.35,-11.6; -10.35,11.6; 10.35,11.6; 10.35,-11.6
CHIPLED_0603 = smd 0.8 x 0.8: A 0,-0.75; C 0,0.75
PTV111-4 = drill 1.2 square: P1 -3.75,0; P2 -1.25,0; P3 1.25,0; P4 3.75,0 | drill 3 square: P$1 -5.8,11; P$2 5.8,11
_0603 = smd 0.9 x 0.8: 1 -0.762,0; 2 0.762,0
SIL6 = drill 0.813 long: 1 -6.35,0; 2 -3.81,0; 3 -1.27,0; 4 1.27,0; 5 3.81,0; 6 6.35,0
PEC111-4XXXK-SXXXX = drill 1 square: A -2.5,-7.5; B 2.5,-7.5; C 0,-7.5; S1 -2.5,7; S2 2.5,7 | drill 2.7 square: P$1 -5.7,0; P$2 5.7,0
SOT223-R = smd 1.3 x 1.3: 1 -2.3,-3.05; 2 0,-3.05; 3 2.3,-3.05 | smd 3.6 x 1.3: 4 0,3.05
TE-292304-1 = drill 0.95 octagon: 1 1.25,4.71; 2 -1.25,4.71; 3 -1.25,2.71; 4 1.25,2.71 | drill 2.3: P$1 6.02,0; P$2 -6.02,0
HC49UP = smd 5.334 x 1.93: 1 -4.826,0; 2 4.826,0

### Placement (x,y rotation side)
B1  -7.49,68.33 180 top  (outside the outline)
B2  -7.49,59.44 180 top  (outside the outline)
BTN1  38.1,62.23 0 top
BTN2  25.4,76.2 0 top
BTN3  38.1,76.2 0 top
BTN4  25.4,48.26 0 top
BTN5  38.1,48.26 0 top
BTN6  25.4,62.23 0 top
C1  8.26,186.69 90 bottom
C2  24.26,103.76 180 top
C3  37.21,36.07 270 top
C4  28.32,93.73 180 top
C5  48.26,10.16 270 top
C6  48.26,17.78 90 top
C7  29.72,23.88 180 top
C8  38.48,22.73 0 top
C9  27.94,21.59 0 top
C10  20.07,2.29 0 bottom
C11  39.5,8 0 top
C12  28.07,9.14 90 top
C13  25.27,10.79 270 top
C14  -4.95,81.03 180 top  (outside the outline)
C15  2.29,17.53 270 bottom
C16  -4.95,73.41 180 top  (outside the outline)
C17  5.84,11.68 90 bottom
C18  33.27,19.05 270 bottom
C19  35.31,18.54 90 bottom
C20  40.77,66.29 0 bottom
C21  20.45,78.87 90 bottom
C22  41.27,80.39 0 bottom
C23  22.73,52.32 0 bottom
C24  39.5,49.4 90 bottom
C25  22.73,66.29 0 bottom
CPU1  34.29,15.24 90 top
D1  12.7,97.79 90 top
D2  20.07,5.84 270 bottom
FADER1  12.7,44.45 90 top
H1  48.26,2.54 0 top
H2  -11.05,88.14 0 top  (outside the outline)
H3  2.54,2.54 0 top
H4  -24.77,75.31 0 top  (outside the outline)
IC1  30.99,37.59 180 top
IC2  23.62,86.87 270 top
IC3  22.35,97.54 270 top
IC4  12.7,183.51 270 bottom
JP1  -31.62,27.69 180 top  (outside the outline)
JP2  10.67,1.52 0 top
JP3  -27.81,30.23 180 top  (outside the outline)
JP4  -21.46,30.23 180 top  (outside the outline)
JP5  1.27,9.91 90 top
JTAG  33.91,2.03 180 top
L1  [0805']  31.5,18.54 270 bottom
LCD1  25.4,226.06 0 top
LED1  38.86,31.75 270 top
POT1  38.1,88.9 0 top
POT2  12.7,114.3 0 top
POT3  12.7,139.7 0 top
POT4  12.7,165.1 0 top
POT5  38.1,165.1 0 top
POT6  38.1,139.7 0 top
POT7  38.1,114.3 0 top
R1  7.11,180.34 0 bottom
R2  9.4,192.79 0 bottom
R3  16.13,192.66 180 bottom
R4  15.88,203.33 180 bottom
R5  2.67,186.18 0 bottom
R6  39.88,203.33 0 bottom
R7  33.02,190.37 0 bottom
R8  43.18,190.5 180 bottom
R9  22.61,180.34 0 bottom
R10  18.03,9.4 180 bottom
R11  14.99,4.83 270 bottom
R12  34.54,7.87 180 top
R13  25.15,5.33 0 top
R14  25.15,7.11 0 top
R15  -32.89,21.34 180 top  (outside the outline)
R16  -32.89,23.88 180 top  (outside the outline)
R17  35.31,31.75 180 top
R18  39.5,62.61 270 bottom
R19  36.7,62.1 270 bottom
R20  29.72,72.01 0 bottom
R21  24,75.31 270 bottom
R22  39.24,75.31 270 bottom
R23  36.7,75.31 270 bottom
R24  29.59,52.32 0 bottom
R25  23.88,49.28 90 bottom
R26  38.73,46.35 0 bottom
R27  36.2,48.26 90 bottom
R28  28.83,57.02 270 bottom
R29  23.88,62.87 90 bottom
RN1  5.08,87.63 90 top
RN2  5.08,104.14 90 top
ROTENC1  38.1,198.12 0 top
ROTENC2  12.7,198.12 0 top
U1  7.37,19.05 0 bottom
X1  -37.97,8.64 180 top  (outside the outline)
Y1  44.45,13.97 270 top

### Tracks (layer width: path | path; a pad name or v marks a point on that pad's centre or on a via)
3.3V  (via drill 0.51)  (2 unrouted)
  Top 0.254: C2.1 25.15,103.71 IC3.16 24.13,101.98 v23.75,102.36 | C3.2 36.78,34.79 IC1.16 35.43,36.2 v35.56,36.32 | IC1.10 v27.81,36.32 | IC3.10 26.84,94.36 C4.2 27.47,93.64 v26.29,92.46 26.42,92.32 IC2.16 | IC2.10 v27.81,83.69 | v6.48,182.25 6.48,182.5 | CPU1.19 37.04,22.14 C8.1 37.63,23.28 v38.35,24 | CPU1.32 29.39,20.99 | 29.39,20.99 C9.2 | 29.39,20.99 29.39,20.14 v29.84,19.68 | v26.92,9.91 27.01,9.99 C12.2 28.54,10.47 CPU1.48 | v38.48,6.35 38.65,6.52 C11.1 38.04,8.61 CPU1.64 | CPU1.1 38.8,11.49 v38.35,11.94 | R17.2 v33.02,31.75
  Bottom 0.254: v26.29,92.46 26.29,92.33 26.16,92.2 25.91,92.2 25.65,91.95 | v23.75,102.36 23.75,102.49 23.37,102.87 | v35.56,36.32 35.81,36.58 | v27.81,36.32 27.81,36.83 | v27.81,83.69 27.94,83.69 | C1.2 9.48,187.54 IC4.16 | R1.2 6.35,182.12 v6.48,182.25 | v38.35,24 38.35,24.13 38.86,24.64 | v29.84,19.68 30.1,19.43 | v26.92,9.91 26.8,9.91 26.67,9.78 | v38.48,6.35 38.35,6.35 38.1,6.1 | v38.35,11.94 37.85,12.45 | v33.02,31.75 32.51,31.75
  pour Bottom: 0.38,240.79 0.38,0.89 4.7,0.89 49.91,0.89 49.91,8.89 49.91,241.05 0.38,241.05
5.0V  (2 unrouted)
  Top 0.813: JP5.1 3.05,6.1 6.86,2.29 JP2.1
  Bottom 0.813: U1.3 2.41,16 | 2.41,16 C15.2 | 2.41,16 2.41,15.11 2.79,14.73 2.79,14.48 3.05,14.22 3.05,7.87 JP5.1
ADC0
  Top 0.254: POT5.P2 36.85,143.11 38.48,141.48 42.93,141.48 43.43,140.97 43.43,132.08 40.13,128.78 40.13,119.38 43.56,115.95 43.56,106.68 39.24,102.36 39.24,98.93 46.35,91.82 46.35,24.89 46.23,24.77 41.91,20.45 41.91,18.92 40.98,17.99 CPU1.14
ADC1
  Top 0.254: POT6.P2 36.85,116.69 38.1,115.44 38.1,105.28 38.73,104.65 38.73,98.68 45.85,91.57 45.85,25.02 45.72,24.89 41.4,20.57 41.4,19.05 40.84,18.49 CPU1.15
ADC2
  Top 0.254: POT7.P2 36.85,105.77 38.23,104.39 38.23,98.55 45.34,91.44 45.34,25.27 40.89,20.83 40.89,19.18 40.71,18.99 CPU1.16
ADC3
  Top 0.254: POT4.P2 11.45,142.47 12.7,141.22 12.7,120.9 18.03,115.57 18.03,112.78 18.41,112.39 29.46,112.39 37.72,104.14 37.72,98.3 44.83,91.19 44.83,25.78 40.04,20.99 CPU1.17
ADC4
  Top 0.254: POT3.P2 11.45,116.95 12.7,115.7 12.7,112.27 13.08,111.89 29.21,111.89 37.21,103.89 37.21,98.04 44.32,90.93 44.32,26.67 42.8,25.15 36.83,25.15 36.54,24.86 CPU1.20
ADC5
  Top 0.254: POT2.P2 11.45,111.99 12.06,111.38 28.96,111.38 36.7,103.63 36.7,97.79 43.81,90.68 43.81,26.92 42.67,25.78 36.7,25.78 36.04,25.12 CPU1.21
ADC6
  Top 0.254: POT1.P2 36.85,85.07 37.97,83.95 41.53,83.95 43.31,82.17 43.31,27.69 42.04,26.42 36.45,26.42 35.54,25.51 CPU1.22
ADC7  (1 unrouted)
AVDD  (via drill 0.51)
  Top 0.254: CPU1.13 36.61,17.49 v36.58,17.53
  Bottom 0.254: v36.58,17.53 35.47,17.53 C19.1 33.32,17.69 C18.2 L1.2
BTN_LED1
  Top 0.254: BTN3.LED1+ 38.1,81.41 29.46,90.04 IC2.15
BTN_LED2
  Top 0.254: BTN3.LED2+ 35.64,75.06 28.32,75.06 27.43,75.95 27.43,80.01 25.27,82.17 25.27,86.11 24.13,87.25 24.13,88.14 23.5,88.77 IC2.3
BTN_LED3
  Top 0.254: IC2.5 23.75,86.23 24.13,85.85 24.13,81.07 24.28,80.92 BTN2.LED1+
BTN_LED4
  Top 0.254: IC2.7 22.1,83.69 23.11,82.68 23.11,79.88 25.4,77.6 BTN2.LED2+
BTN_LED5
  Top 0.254: BTN1.LED1+ 37.76,66.17 28.7,66.17 27.69,67.18 27.69,72.9 26.92,73.66 26.92,79.88 24.77,82.04 24.77,85.98 23.24,87.5 IC2.4
BTN_LED6
  Top 0.254: IC1.3 32.89,41.02 36.83,44.96 36.83,50.59 BTN5.LED1+
BTN_LED7
  Top 0.254: IC1.6 29.08,42.29 26.42,44.96 26.42,50.84 BTN4.LED1+
BTN_LED8
  Top 0.254: IC1.7 27.81,42.25 BTN4.LED2+
BTN_LED9
  Top 0.254: IC2.6 23.24,84.96 23.62,84.58 23.62,80.01 25.15,78.49 26.16,78.49 26.42,78.23 26.42,73.53 27.18,72.77 27.18,67.06 28.57,65.66 29.08,65.66 30.73,65.66 36.58,65.66 38.1,64.14 BTN1.LED2+
BTN_LED10
  Top 0.254: IC1.2 34.16,40.72 BTN5.LED2+
BTN_LED11
  Top 0.254: IC1.4 31.62,41.27 27.43,45.47 27.43,63.8 BTN6.LED1+
BTN_LED12
  Top 0.254: IC1.5 30.35,41.78 26.92,45.21 26.92,57.11 BTN6.LED2+
CAN_H  (via drill 0.51)
  Top 0.254: JP5.2 2.29,8.64 v4.06,6.86 | JP2.2 v7.37,3.56
  Bottom 0.254: D2.7 15.88,6.48 R11.1 13.46,5.59 JP2.2 | v7.37,3.56 v4.06,6.86
CAN_L  (via drill 0.51)
  Top 0.254: JP5.3 2.29,11.18 3.81,9.65 v4.06,9.65 | JP2.3 11.94,1.78 v9.14,4.57
  Bottom 0.254: D2.6 16.13,5.21 R11.2 14.48,4.06 JP2.3 | v9.14,4.57 v4.06,9.65
CAN_RX  (via drill 0.51)
  Top 0.254: R13.1 24.38,4.57 v24.89,4.06
  Bottom 0.254: v24.89,4.06 22.99,4.06 D2.4
CAN_TX  (via drill 0.51)  (1 unrouted)
  Top 0.254: R14.1 24.38,7.87 v23.11,9.14
  Bottom 0.254: v23.11,9.14 22.86,9.14 22.61,8.89 22.61,8.01
DIN_1
  Bottom 0.254: R2.1 10.16,190.66 ROTENC2.A 10.2,190.16 9.53,189.48 6.6,189.48 6.1,188.98 6.1,184.66 9.14,181.61 IC4.11
DIN_2
  Bottom 0.254: IC4.12 10.16,182.88 12.06,184.78 12.06,188.47 12.45,188.85 13.97,188.85 15.2,190.08 ROTENC2.B 15.37,190.79 R3.1
DIN_3
  Bottom 0.254: ROTENC2.S2 15.2,203.41 R4.1 15.11,195.2 11.56,191.64 11.56,185.04 10.67,184.15 IC4.13
DIN_4  (1 unrouted)
DIN_5
  Bottom 0.254: ROTENC1.S2 40.6,203.37 R6.1 40.64,199.14 33.4,191.9 31.75,191.9 30.99,191.13 30.99,186.44 30.1,185.55 15.63,185.55 IC4.3
DIN_6
  Bottom 0.254: ROTENC1.A 34.03,190.62 R7.1 33.78,186.18 31.75,184.15 IC4.4
DIN_7
  Bottom 0.254: R8.1 41.27,190.5 41.15,190.37 40.85,190.37 ROTENC1.B 40.6,187.16 38.48,185.04 37.21,183.77 36.32,182.88 IC4.5
DIN_8  (1 unrouted)
DIN_TODO
  Bottom 0.254: BTN1.SW4 BTN1.SW3 41.35,64.86 C20.2
DIN_TODO2
  Bottom 0.254: C23.2 21.88,50.78 BTN4.SW4
GND  (via drill 0.51)  (11 unrouted)
  Top 0.254: v28.7,70.61 28.57,70.61 28.45,70.48 | v28.83,53.85 28.83,53.34 | v8.26,184.28 8.26,184.15 8.13,184.02 | v13.46,179.96 13.46,180.09 13.21,180.34 | CPU1.18 37.54,21.66 37.72,21.84 38.57,21.84 39.33,22.61 C8.2 | v20.83,7.11 20.32,7.62 | v19.3,7.62 19.56,7.37 | v33.27,22.35 33.27,22.61
  Top 0.813: v7.62,9.65 8.13,9.14 | v5.33,18.54 5.59,18.29 | v8.89,18.29 8.64,18.54
  Bottom 0.254: R23.2 R22.2 39.75,73.95 BTN3.SW1 42.8,75.4 42.8,78.61 42.12,79.29 C22.1 | R21.2 23.49,73.95 BTN2.SW2 20.45,75.65 C21.1 | R20.2 28.87,70.78 v28.7,70.61 | R18.2 41.28,59.98 BTN1.SW1 42.8,61.43 42.8,62.87 42.55,63.12 42.55,65.66 41.91,66.29 C20.1 | R19.2 36.12,61.25 BTN1.SW2 | R28.2 v28.83,53.85 28.74,53.76 R24.2 | C25.1 23.58,64.01 R29.2 24.04,63.72 24.89,62.87 24.89,60.96 24.77,60.83 23,60.83 BTN6.SW2 | C23.1 23.58,50.42 R25.2 24.89,49.11 24.89,47.12 23.79,46.01 BTN4.SW2 | C24.1 38.99,48.55 | 38.99,48.55 36.75,48.55 R27.2 | 38.99,48.55 37.88,47.45 R26.2 37.54,46.01 BTN5.SW2 | v8.26,184.28 C1.1 9.11,186.69 IC4.15 | IC4.8 14.35,179.07 v13.46,179.96 | D2.2 21.46,6.48 | 21.46,6.48 v20.83,7.11 | R10.2 18.8,8.13 v19.3,7.62 | C10.2 19.22,4.23 21.46,6.48 | C19.2 34.33,19.39 C18.1 v33.27,22.35
  Bottom 0.813: C17.1 6.99,10.28 v7.62,9.65 | C15.1 4.95,18.93 v5.33,18.54 | U1.1 9.67,17.51 v8.89,18.29
  pour Top: 0.64,240.54 0.64,0.64 4.95,0.64 50.16,0.64 50.16,8.64 50.16,240.79 0.64,240.79
LCD_CLK  (via drill 0.51)
  Top 0.254: LCD1.P$3 24.13,234.95 46.74,212.34 46.74,92.46 46.99,92.2 46.99,24.38 v46.23,23.62 | v33.53,12.95 33.53,11.68 33.54,11.67 CPU1.55
  Bottom 0.254: v46.23,23.62 43.69,23.62 33.53,13.46 v33.53,12.95
LCD_CS  (via drill 0.51)
  Top 0.254: LCD1.P$5 29.21,231.39 47.75,212.85 47.75,92.96 48.01,92.71 48.01,22.35 46.99,21.34 v46.74,21.34 | v36.07,12.45 35.81,12.45 35.05,11.68 35.05,9.5 CPU1.58
  Bottom 0.254: v46.74,21.34 42.93,21.34 36.07,14.48 v36.07,12.45
LCD_DC  (via drill 0.51)
  Top 0.254: LCD1.P$6 31.75,229.62 48.26,213.11 48.26,93.22 48.51,92.96 48.51,21.34 v48.26,21.08 | v37.34,14.48 37.34,12.45 35.56,10.67 35.56,9.51 CPU1.59
  Bottom 0.254: v48.26,21.08 48.01,21.08 47.5,20.57 43.43,20.57 v37.34,14.48
LCD_MOSI  (via drill 0.51)
  Top 0.254: LCD1.P$4 26.67,233.17 47.24,212.6 47.24,92.71 47.5,92.46 47.5,23.37 46.74,22.61 v45.72,22.61 | v34.54,12.45 CPU1.57
  Bottom 0.254: v34.54,12.45 34.54,13.72 43.43,22.61 v45.72,22.61
N$1
  Top 0.254: CPU1.6 43.07,13.99 44.45,15.37 Y1.1 44.62,18.63 C6.2
N$2
  Top 0.254: CPU1.5 43.28,13.49 44.32,12.45 44.32,11.18 44.45,11.05 44.45,10.79 44.7,10.54 44.7,9.4 Y1.2 44.62,9.31 C5.2
N$3
  Top 0.254: CPU1.47 25.52,11.99 C13.1
N$4
  Top 0.254: CPU1.31 31.04,23.5 C7.1
N$5
  Top 0.254: R17.1 LED1.A
N$6
  Top 0.254: CPU1.60 36.04,8.61 R12.1
N$7  (1 unrouted)
N$8  (1 unrouted)
N$9
  Bottom 0.254: BTN1.LED1- 40.73,62.23 R18.1
N$10
  Bottom 0.254: R19.1 35.22,62.95 BTN1.LED2-
N$11
  Top 0.254: IC2.1 18.92,91.31 D1.2
N$12  (via drill 0.51)
  Top 0.254: IC2.9 v27.3,81.53 | v32.89,36.45 IC1.14
  Bottom 0.254: v27.3,81.53 27.3,38.73 29.21,36.83 32.51,36.83 v32.89,36.45
N$13
  Top 0.254: CPU1.62 37.04,6.81 36.32,6.1 26.67,6.1 R13.2
N$14
  Top 0.254: RN1.2 6.35,83.82 D1.20
N$15
  Top 0.254: RN1.3 6.35,86.36 D1.19
N$16
  Top 0.254: RN1.4 6.35,88.9 D1.18
N$17
  Top 0.254: RN1.5 6.35,91.44 D1.17
N$18
  Top 0.254: RN1.6 6.35,93.98 D1.16
N$19
  Top 0.254: RN2.2 7.62,100.33 D1.15
N$20
  Top 0.254: RN2.3 7.62,102.87 D1.14
N$21
  Top 0.254: RN2.4 7.62,105.41 D1.13
N$22
  Top 0.254: RN2.5 7.62,107.95 D1.12
N$23
  Top 0.254: RN2.6 7.62,110.49 D1.11
N$24
  Bottom 0.254: R20.1 30.57,74.63 BTN2.LED1-
N$25
  Bottom 0.254: R21.1 21.84,76.16 BTN2.LED2-
N$26
  Bottom 0.254: C21.2 20.88,79.72 BTN2.SW4
N$27
  Top 0.254: CPU1.61 36.54,7.08 36.07,6.6 26.42,6.6 R14.2
N$28
  Bottom 0.254: IC4.10 R1.1
N$29
  Bottom 0.254: R24.1 30.44,49.7 BTN4.LED1-
N$30
  Bottom 0.254: R25.1 21.97,48.43 BTN4.LED2-
N$31
  Top 0.254: IC2.2 18.41,90.04 18.03,89.66 18.03,87.88 D1.1
N$34
  Bottom 0.254: R26.1 39.8,46.35 BTN5.LED1-
N$35
  Bottom 0.254: R27.1 35.35,47.41 BTN5.LED2-
N$36
  Bottom 0.254: BTN5.SW4 39.24,50.51 C24.2 39.75,50.51 BTN5.SW3
N$39
  Bottom 0.254: BTN3.LED1- 39.28,76.2 R22.1
N$40
  Bottom 0.254: BTN3.LED2- 36.66,76.2 R23.1
N$41
  Bottom 0.254: BTN3.SW4 BTN3.SW3 40.42,79.38 C22.2
N$44
  Bottom 0.254: BTN6.LED1- 29.08,62.23 29.72,61.59 29.72,58.76 R28.1
N$45
  Bottom 0.254: R29.1 22.02,62.02 BTN6.LED2-
N$46
  Bottom 0.254: C25.2 21.88,64.75 BTN6.SW4
N$49
  Top 0.254: IC3.15 24.26,100.71 18.54,106.43 18.54,107.19 D1.10
N$50
  Top 0.254: IC3.1 19.55,103.64 D1.9
N$51
  Top 0.254: IC3.2 18.67,100.71 18.29,101.09 18.29,102.36 D1.8
N$52
  Top 0.254: IC3.3 18.67,99.44 D1.7
N$53
  Top 0.254: IC3.4 17.4,98.17 D1.6
N$54
  Top 0.254: IC3.5 16.89,96.9 D1.5
N$55
  Top 0.254: IC3.6 18.16,95.63 D1.4
N$56
  Top 0.254: IC3.7 19.43,94.36 D1.3
N$57
  Top 0.254: IC3.9 25.15,89.02 25.4,88.77 IC2.14
N$73
  Bottom 0.254: R10.1 D2.8
NRST  (via drill 0.51)  (3 unrouted)
  Top 0.254: CPU1.7 39.13,14.49 v38.35,13.72
  Bottom 0.254: v38.35,13.72 37.85,13.72 37.08,12.95 37.08,2.67 JTAG.2
PB2  (2 unrouted)
SPI2_CLK  (via drill 0.51)
  Top 0.254: IC3.11 26.29,95.63 v26.42,95.5 | v27.69,85.47 27.69,85.22 27.43,84.96 IC2.11 | v29.08,38.1 IC1.11 29.08,34.16 24.77,29.84 24.77,20.57 26.85,18.49 CPU1.34
  Bottom 0.254: v29.08,38.1 30.86,39.88 30.86,50.8 31.62,51.56 31.62,53.21 30.23,54.61 30.23,69.98 31.75,71.5 31.75,73.15 31.11,73.79 31.11,74.93 30.48,75.56 30.48,76.58 29.97,77.09 29.97,78.74 28.96,79.76 28.96,84.2 v27.69,85.47 27.05,86.11 27.05,94.87 v26.42,95.5 26.42,103.12 23.11,106.43 23.11,164.47 12.32,175.26 12.32,180.97 13.84,182.5 13.84,186.18 14.35,186.69 IC4.2
SPI2_MISO  (via drill 0.51)
  Top 0.254: CPU1.35 26.59,17.99 24.51,20.07 16,20.07 v15.62,20.45
  Bottom 0.254: IC4.9 9.9,173.86 8.76,172.72 4.19,172.72 3.68,172.21 3.68,113.92 2.29,112.52 2.29,33.78 v15.62,20.45
SPI2_MOSI  (via drill 0.51)
  Top 0.254: IC3.14 23.75,99.44 v23.62,99.31 | CPU1.36 25.56,17.49 v24,19.05
  Bottom 0.254: v23.62,99.31 23.62,83.69 26.8,80.52 26.8,30.86 24,28.07 v24,19.05
SPI2_RC1  (via drill 0.51)
  Top 0.254: IC3.12 24.64,96.9 23.88,96.14 23.88,90.04 24.64,89.28 24.64,87.38 25.78,86.23 IC2.12 28.45,86.23 28.96,85.72 28.96,80.9 29.84,80.01 v29.97,80.01 | v30.35,37.59 IC1.12 30.35,34.29 25.27,29.21 25.27,21.59 27.87,18.99 CPU1.33
  Bottom 0.254: v30.35,37.59 30.35,37.85 31.37,38.86 31.37,50.67 32.13,51.44 32.13,53.34 30.73,54.74 30.73,69.72 30.86,69.85 31.18,70.17 32.26,71.25 32.26,73.28 31.62,73.91 31.62,75.06 30.99,75.69 30.99,76.83 30.61,77.22 30.61,79.38 v29.97,80.01
SPI2_RC2  (via drill 0.51)
  Top 0.254: CPU1.37 23.27,16.99 v23.24,17.02
  Bottom 0.254: IC4.1 14.86,187.96 13.34,186.44 13.34,182.75 11.81,181.23 11.81,175.01 9.02,172.21 4.45,172.21 4.19,171.96 4.19,113.79 2.79,112.39 2.79,37.47 v23.24,17.02
SWCK  (via drill 0.51)
  Top 0.254: CPU1.49 30.54,8.58 v31.24,7.87
  Bottom 0.254: v31.24,7.87 31.24,4.7 JTAG.3
SWDIO  (via drill 0.51)
  Top 0.254: CPU1.46 29.93,12.49 v30.48,11.94
  Bottom 0.254: v30.48,11.94 30.48,2.92 JTAG.4
USB_DM  (1 unrouted)
USB_DP  (1 unrouted)
USB_VBUS  (2 unrouted)